# EasyEDA schematic esp32c3.json
TITLE: Sheet_1; REV: 1.0; Date: 2026-03-17; Sheet: 1/1; Company: Your Company
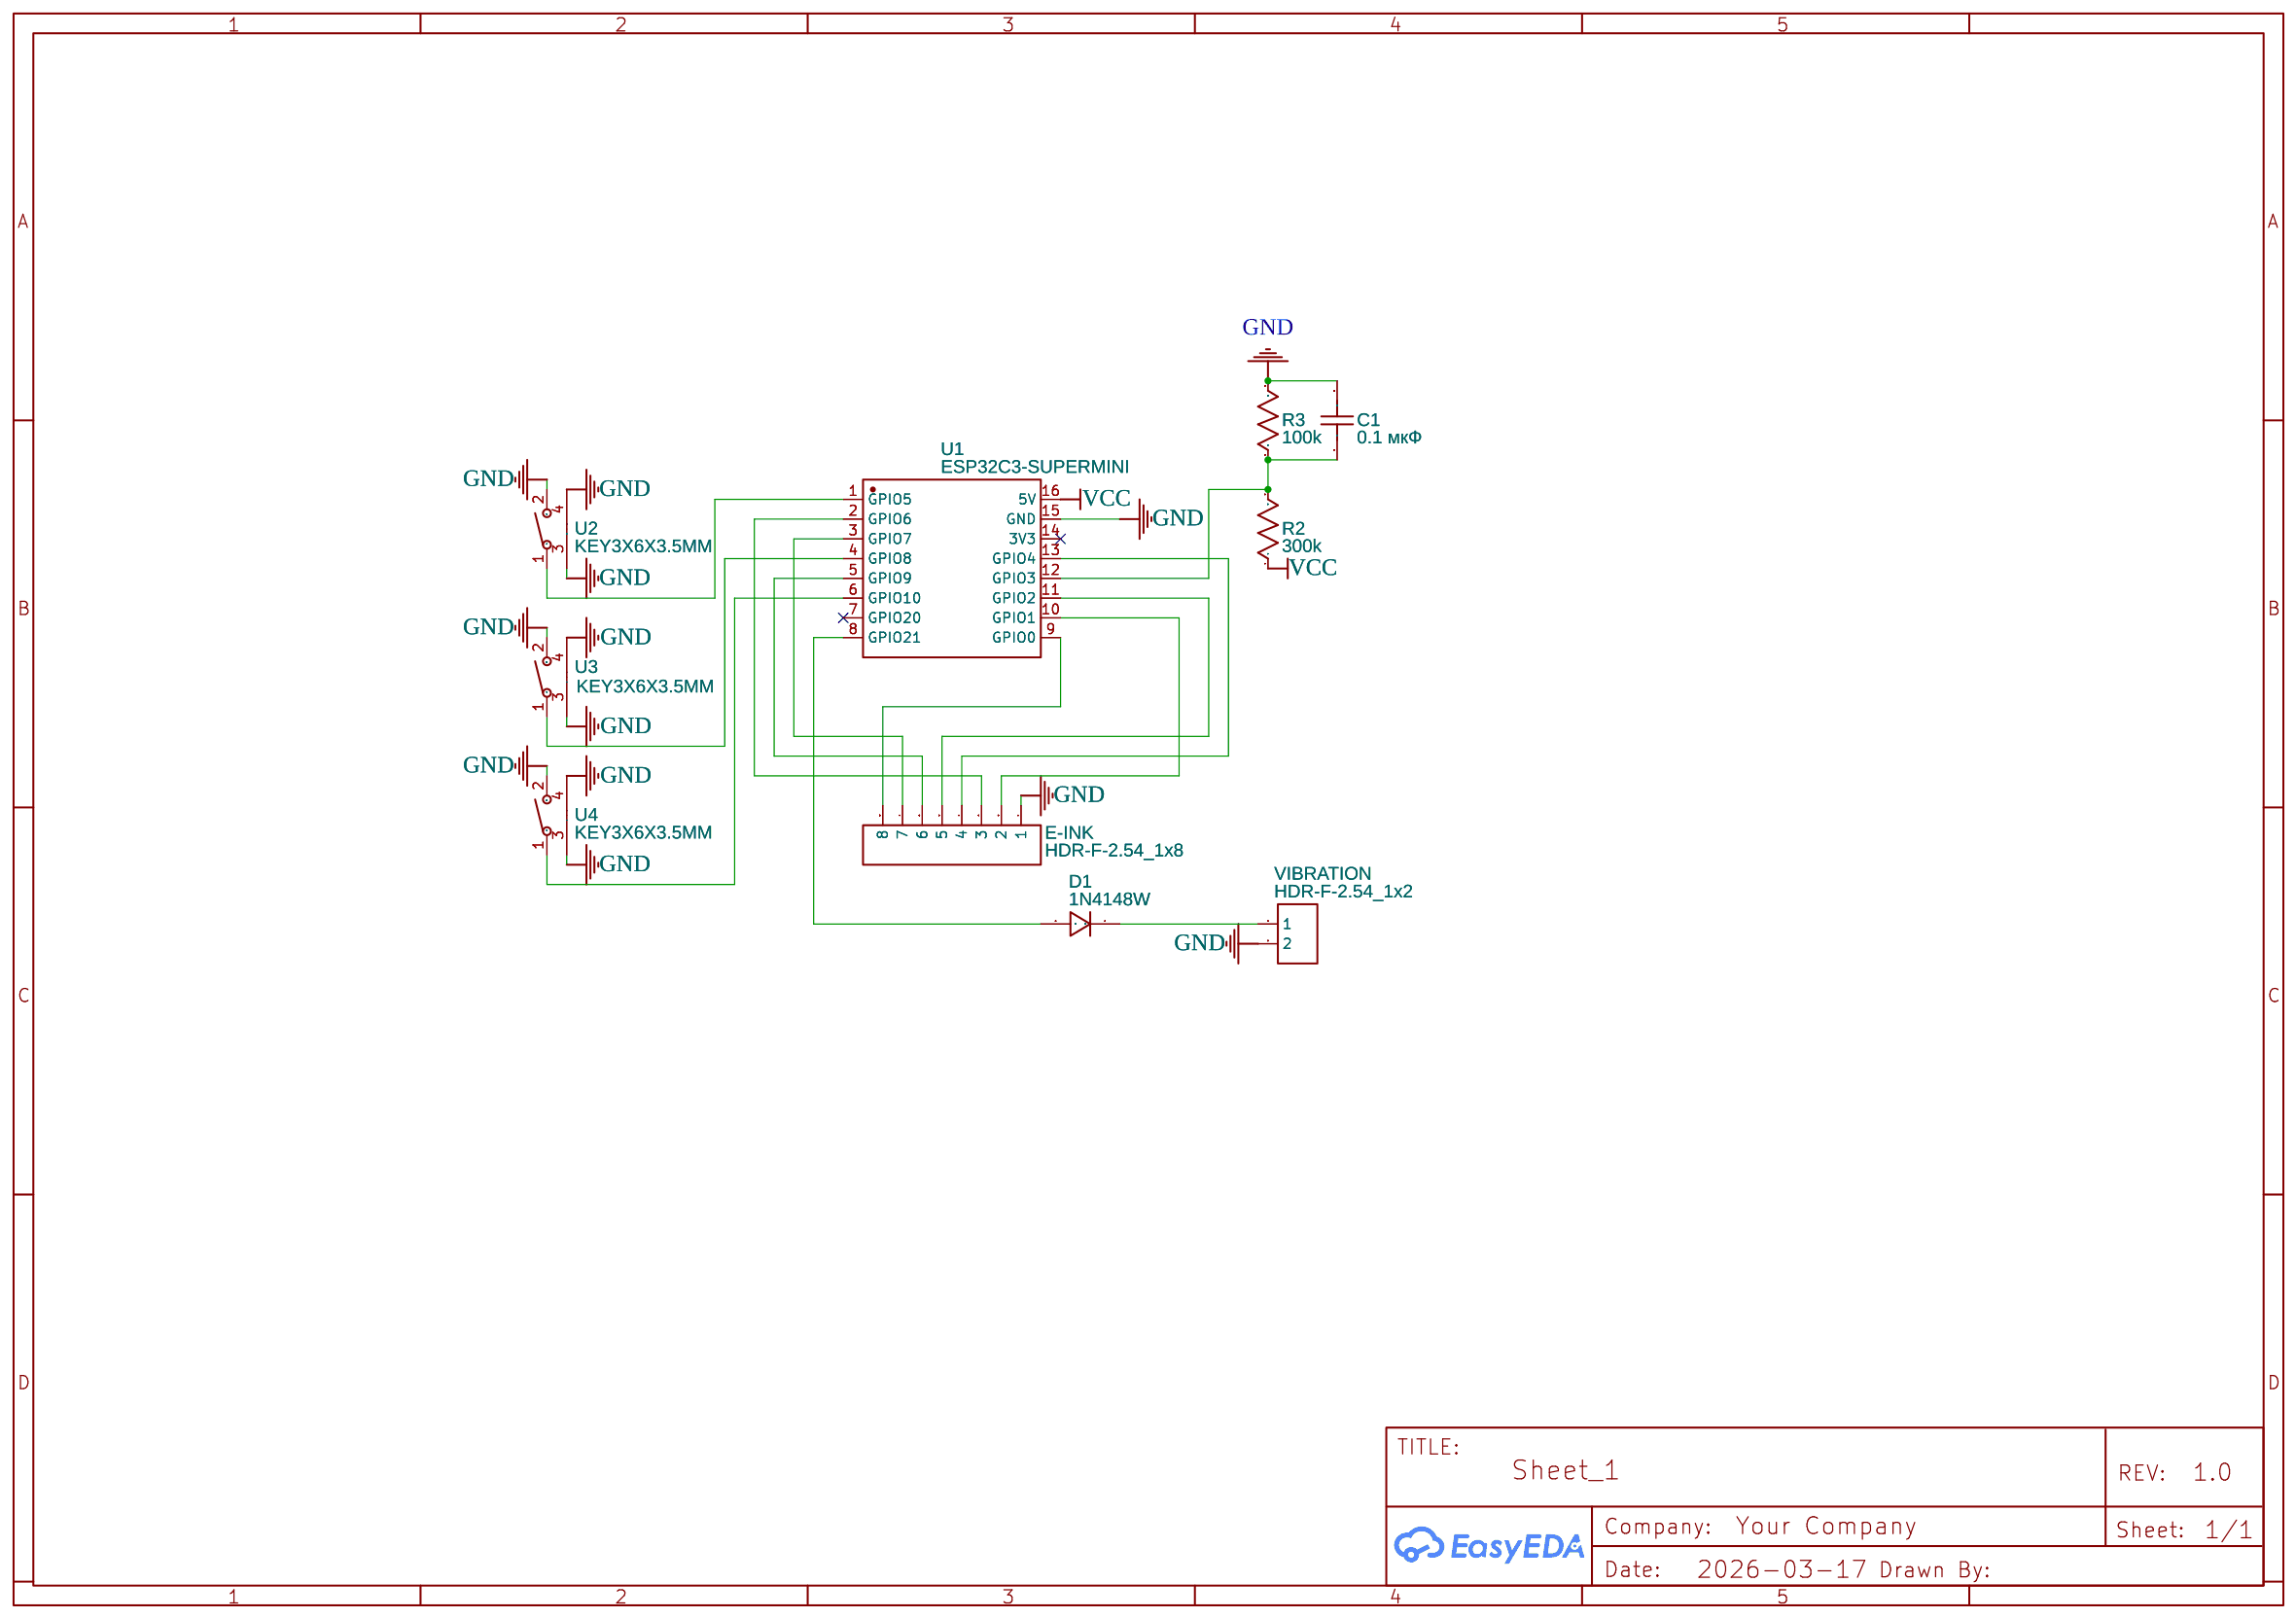
[diagram p0: schematic sheet]

## Parts
C1  0.1 мкФ  [C0603]
D1  1N4148W  [SOD-123FL_L2.6-W1.6-LS3.4-RD]
E-INK  HDR-F-2.54_1x8  [HDR-F-2.54_1X8]
R2  300k  [R0805]
R3  100k  [R0603]
U1  ESP32C3-SUPERMINI  [COMM-SMD_16P-L22.5-W18.0-P2.54-TL]
U2  KEY3X6X3.5MM  [KEY-SMD_KEY3-6-3.5MM]
U3  KEY3X6X3.5MM  [KEY-SMD_KEY3-6-3.5MM]
U4  KEY3X6X3.5MM  [KEY-SMD_KEY3-6-3.5MM]
VIBRATION  HDR-F-2.54_1x2  [HDR-F-2.54_1X2]

## Library data of the parts
C1 = C_0603_US: Contributor: LCEDA_Lib
D1 = 1N4148W: Supplier: LCSC; Manufacturer: Tak Cheong; Contributor: LCEDA_Lib; Supplier Part: C129216
E-INK = HDR-F-2.54_1x8: Supplier Part: C225505; Supplier: LCSC; Contributor: LCEDA_Lib
R2 = R_0805_US: Contributor: LCEDA_Lib
R3 = R_0603_US: Contributor: LCEDA_Lib
U1 = ESP32C3-SUPERMINI: Supplier: LCSC; Supplier Part: C9900147397; Manufacturer: null; Manufacturer Part: ESP32C3-SuperMini; JLCPCB Part Class: Extended Part; Contributor: lcsc
U2-U4 = KEY3X6X3.5MM: Supplier: LCSC; Supplier Part: C9900001594; JLCPCB Part Class: Extended Part; link: https://img.jlc.com//pdf/applyPasteComponent/2021-11-09/17037S/9d62a05b30cd49fa80ab84c57aed797b/%E8%BD%BB%E8%A7%A6%E5%BC%80%E5%85%B3.pdf; Contributor: LCSC
VIBRATION = HDR-F-2.54_1x2: Supplier Part: C49661; Supplier: LCSC; Contributor: LCEDA_Lib

## Nets
GND: C1.2 E-INK.1 R3.2 U1.15(GND) U2.2 U2.3 U2.4 U3.2 U3.3 U3.4 U4.2 U4.3 U4.4 VIBRATION.2
VCC: R2.1 U1.16(5V)
Net-(C1-1): C1.1 R2.2 R3.1 U1.12(GPIO3)
Net-(D1-1): D1.1 VIBRATION.1
Net-(D1-2): D1.2 U1.8(GPIO21)
Net-(E-INK-2): E-INK.2 U1.10(GPIO1)
Net-(E-INK-3): E-INK.3 U1.2(GPIO6)
Net-(E-INK-4): E-INK.4 U1.13(GPIO4)
Net-(E-INK-5): E-INK.5 U1.11(GPIO2)
Net-(E-INK-6): E-INK.6 U1.5(GPIO9)
Net-(E-INK-7): E-INK.7 U1.3(GPIO7)
Net-(E-INK-8): E-INK.8 U1.9(GPIO0)
Net-(U1-1): U1.1(GPIO5) U2.1
Net-(U1-4): U1.4(GPIO8) U3.1
Net-(U1-6): U1.6(GPIO10) U4.1

Not connected (* = marked no-connect by the designer): U1 7(GPIO20)* 14(3V3)*
